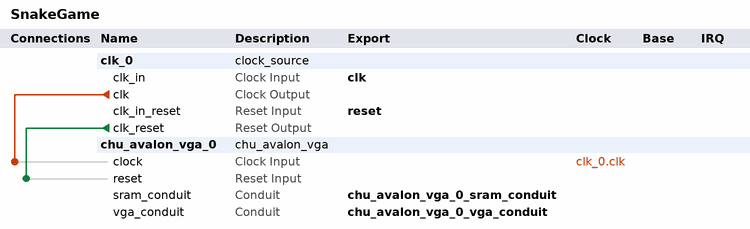
[diagram p0: system contents]
# Platform Designer (Qsys) system SnakeGame, Cyclone V 5CSEMA5F31C6
# Parameters at their usual value, and those the tool derives, are not listed.
package require -exact qsys 18.1
create_system SnakeGame
set_project_property DEVICE_FAMILY {Cyclone V}
set_project_property DEVICE 5CSEMA5F31C6

add_instance clk_0 clock_source 18.1
set_instance_parameter_value clk_0 clockFrequency 50000000

add_instance chu_avalon_vga_0 chu_avalon_vga 1.0

# connections
add_connection clk_0.clk chu_avalon_vga_0.clock clock
add_connection clk_0.clk_reset chu_avalon_vga_0.reset reset

# exported interfaces
add_interface chu_avalon_vga_0_sram_conduit conduit end
set_interface_property chu_avalon_vga_0_sram_conduit EXPORT_OF chu_avalon_vga_0.sram_conduit
add_interface chu_avalon_vga_0_vga_conduit conduit end
set_interface_property chu_avalon_vga_0_vga_conduit EXPORT_OF chu_avalon_vga_0.vga_conduit
add_interface clk clock sink
set_interface_property clk EXPORT_OF clk_0.clk_in
add_interface reset reset sink
set_interface_property reset EXPORT_OF clk_0.clk_in_reset

set_interconnect_requirement {$system} qsys_mm.clockCrossingAdapter HANDSHAKE
set_interconnect_requirement {$system} qsys_mm.enableEccProtection FALSE
set_interconnect_requirement {$system} qsys_mm.insertDefaultSlave FALSE
set_interconnect_requirement {$system} qsys_mm.maxAdditionalLatency 1

save_system SnakeGame.qsys
